# EAGLE design Output (EAGLE 7.2.0)
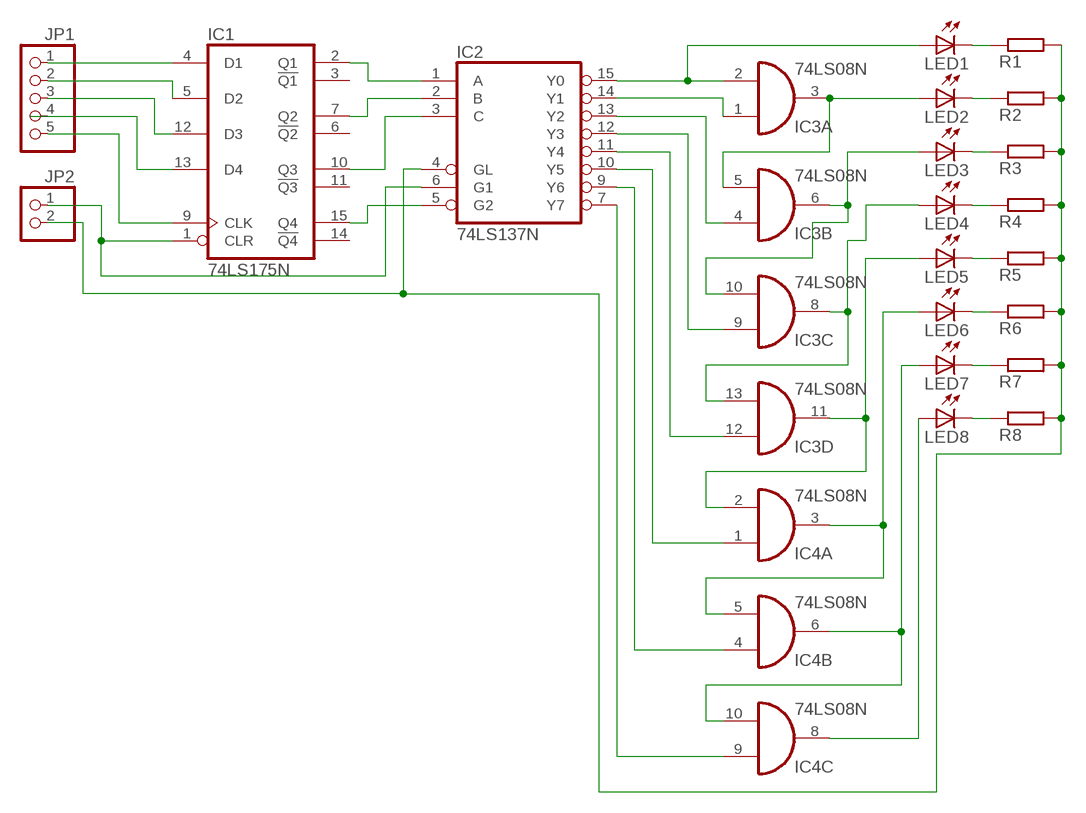
[diagram p0: schematic, sheet 1]

## Parts
IC1  74LS175N  [DIL16]
IC2  74LS137N  [DIL16]
IC3  74LS08N  [DIL14]
IC4  74LS08N  [DIL14]
JP1  PINHD-1X5  [1X05]
JP2  PINHD-1X2  [1X02]
LED1  LED5MM  [LED5MM]
LED2  LED5MM  [LED5MM]
LED3  LED5MM  [LED5MM]
LED4  LED5MM  [LED5MM]
LED5  LED5MM  [LED5MM]
LED6  LED5MM  [LED5MM]
LED7  LED5MM  [LED5MM]
LED8  LED5MM  [LED5MM]
R1  R-EU_0207/10  [0207/10]
R2  R-EU_0207/10  [0207/10]
R3  R-EU_0207/10  [0207/10]
R4  R-EU_0207/10  [0207/10]
R5  R-EU_0207/10  [0207/10]
R6  R-EU_0207/10  [0207/10]
R7  R-EU_0207/10  [0207/10]
R8  R-EU_0207/10  [0207/10]

## Nets
N$1: IC1.4(D1) JP1.1
N$2: IC1.5(D2) JP1.2
N$3: IC1.12(D3) JP1.3
N$4: IC1.13(D4)
N$5: IC1.9(CLK) JP1.5
N$6: IC1.1(CLR) IC2.6(G1) JP2.1
N$7: IC1.2(Q1) IC2.1(A)
N$8: IC1.7(Q2) IC2.2(B)
N$9: IC1.10(Q3) IC2.3(C)
N$10: IC1.15(Q4) IC2.5(G2)
N$11: IC2.4(GL) JP2.2 R1.2 R2.2 R3.2 R4.2 R5.2 R6.2 R7.2 R8.2
N$12: LED4.K(C) R4.1
N$13: LED1.K(C) R1.1
N$14: LED2.K(C) R2.1
N$15: LED3.K(C) R3.1
N$16: LED5.K(C) R5.1
N$17: LED6.K(C) R6.1
N$18: LED7.K(C) R7.1
N$19: LED8.K(C) R8.1
N$21: IC2.15(Y0) IC3.2(A:I1) LED1.A
N$22: IC2.14(Y1) IC3.1(A:I0)
N$23: IC3.3(A:O) IC3.5(B:I1) LED2.A
N$24: IC2.13(Y2) IC3.4(B:I0)
N$25: IC3.6(B:O) IC3.10(C:I1) LED3.A
N$26: IC3.8(C:O) IC3.13(D:I1) LED4.A
N$27: IC3.11(D:O) IC4.2(A:I1) LED5.A
N$28: IC4.3(A:O) IC4.5(B:I1) LED6.A
N$29: IC4.6(B:O) IC4.10(C:I1) LED7.A
N$30: IC4.8(C:O) LED8.A
N$31: IC2.12(Y3) IC3.9(C:I0)
N$32: IC2.11(Y4) IC3.12(D:I0)
N$33: IC2.10(Y5) IC4.1(A:I0)
N$34: IC2.9(Y6) IC4.4(B:I0)
N$35: IC2.7(Y7) IC4.9(C:I0)
Unconnected: IC1.3(!Q1) IC1.6(!Q2) IC1.11(!Q3) IC1.14(!Q4) IC4.11(D:O) IC4.12(D:I0) IC4.13(D:I1) JP1.4

## Power pins joined to a net without a drawn wire
GND: IC1.8(GND) IC2.8(GND) IC3.7(P:GND) IC4.7(P:GND)
VCC: IC1.16(VCC) IC2.16(VCC) IC3.14(P:VCC) IC4.14(P:VCC)

## Library data of the parts
IC1 = 74xx-eu:74*175: Qadruple D type FLIP FLOP, clear
IC2 = 74xx-eu:74*137: 3-line to 8-line DECODER/DEMULTIPLEXER, address LATCH
IC3 IC4 = 74xx-eu:74*08: Quad 2-input AND gate
JP1 = pinhead:PINHD-1X5: PIN HEADER
JP2 = pinhead:PINHD-1X2: PIN HEADER
LED1-LED8 = led:LED: LED OSRAM: - CHIPLED LG R971, LG N971, LY N971, LG Q971, LY Q971, LO R971, LY R971 LH N974, LH R974 LS Q976, LO Q976, LY Q976 LO Q996 - Hyper CHIPLED LW Q18S LB Q993, LB Q99A, LB R99A - SideLED LS A670, LO A670, LY A670, LG A670, LP A670 LB A673, LV A673, LT A673, LW A673 LH A674 LY A675 LS A676, LA A676, LO A676, LY A676, LW A676 LS A679, LY A679, LG A679 - Hyper Micro SIDELED® LS Y876, LA Y876, LO Y876, LY Y876 LT Y87S - SmartLED LW L88C, LW L88S LB L89C, LB L89S, LG L890 LS L89K, LO L89K, LY L89K LS L896, LA L896, LO L896, LY L896 - TOPLED LS T670, LO T670, LY T670, LG T670, LP T670 LSG T670, LSP T670, LSY T670, LOP T670, LYG T670 LG T671, LOG T671, LSG T671 LB T673, LV T673, LT T673, LW T673 LH T674 LS T676, LA T676, LO T676, LY T676, LB T676, LH T676, LSB T676, LW T676 LB T67C, LV T67C, LT T67C, LS T67K, LO T67K, LY T67K, LW E67C LS E67B, LA E67B, LO E67B, LY E67B, LB E67C, LV E67C, LT E67C LW T67C LS T679, LY T679, LG T679 LS T770, LO T770, LY T770, LG T770, LP T770 LB T773, LV T773, LT T773, LW T773 LH T774 LS E675, LA E675, LY E675, LS T675 LS T776, LA T776, LO T776, LY T776, LB T776 LHGB T686 LT T68C, LB T68C - Hyper Mini TOPLED® LB M676 - Mini TOPLED Santana® LG M470 LS M47K, LO M47K, LY M47K Source: http://www.osram.convergy.de LUXEON: - LUMILED® LXK2-PW12-R00, LXK2-PW12-S00, LXK2-PW14-U00, LXK2-PW14-V00 LXK2-PM12-R00, LXK2-PM12-S00, LXK2-PM14-U00 LXK2-PE12-Q00, LXK2-PE12-R00, LXK2-PE12-S00, LXK2-PE14-T00, LXK2-PE14-U00 LXK2-PB12-K00, LXK2-PB12-L00, LXK2-PB12-M00, LXK2-PB14-N00, LXK2-PB14-P00, LXK2-PB14-Q00 LXK2-PR12-L00, LXK2-PR12-M00, LXK2-PR14-Q00, LXK2-PR14-R00 LXK2-PD12-Q00, LXK2-PD12-R00, LXK2-PD12-S00 LXK2-PH12-R00, LXK2-PH12-S00 LXK2-PL12-P00, LXK2-PL12-Q00, LXK2-PL12-R00 Source: www.luxeon.com KINGBRIGHT: KA-3528ASYC Source: www.kingbright.com
R1-R8 = rcl:R-EU_: RESISTOR, European symbol

## Board
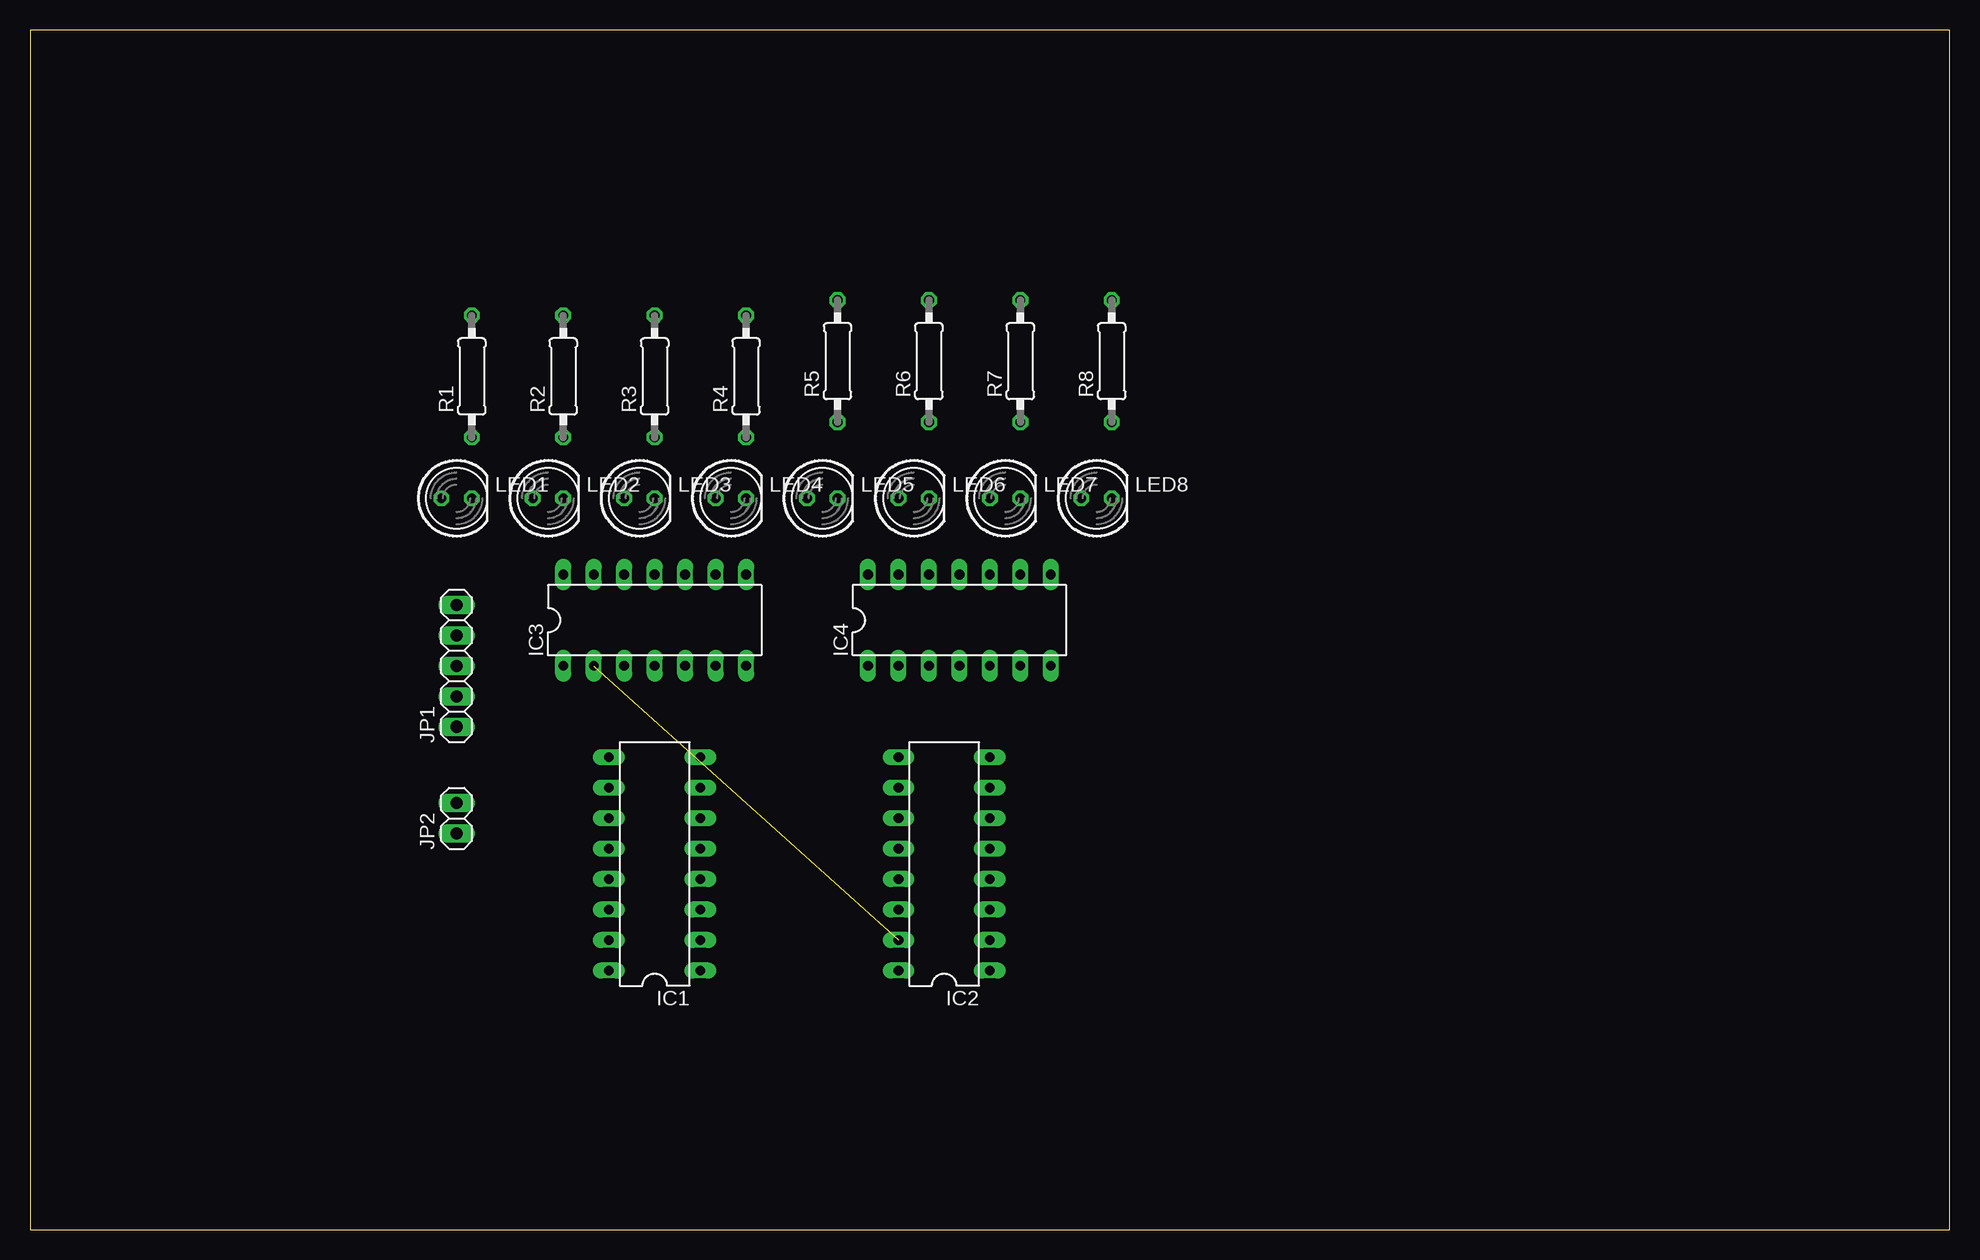
[diagram p1: board, top side]
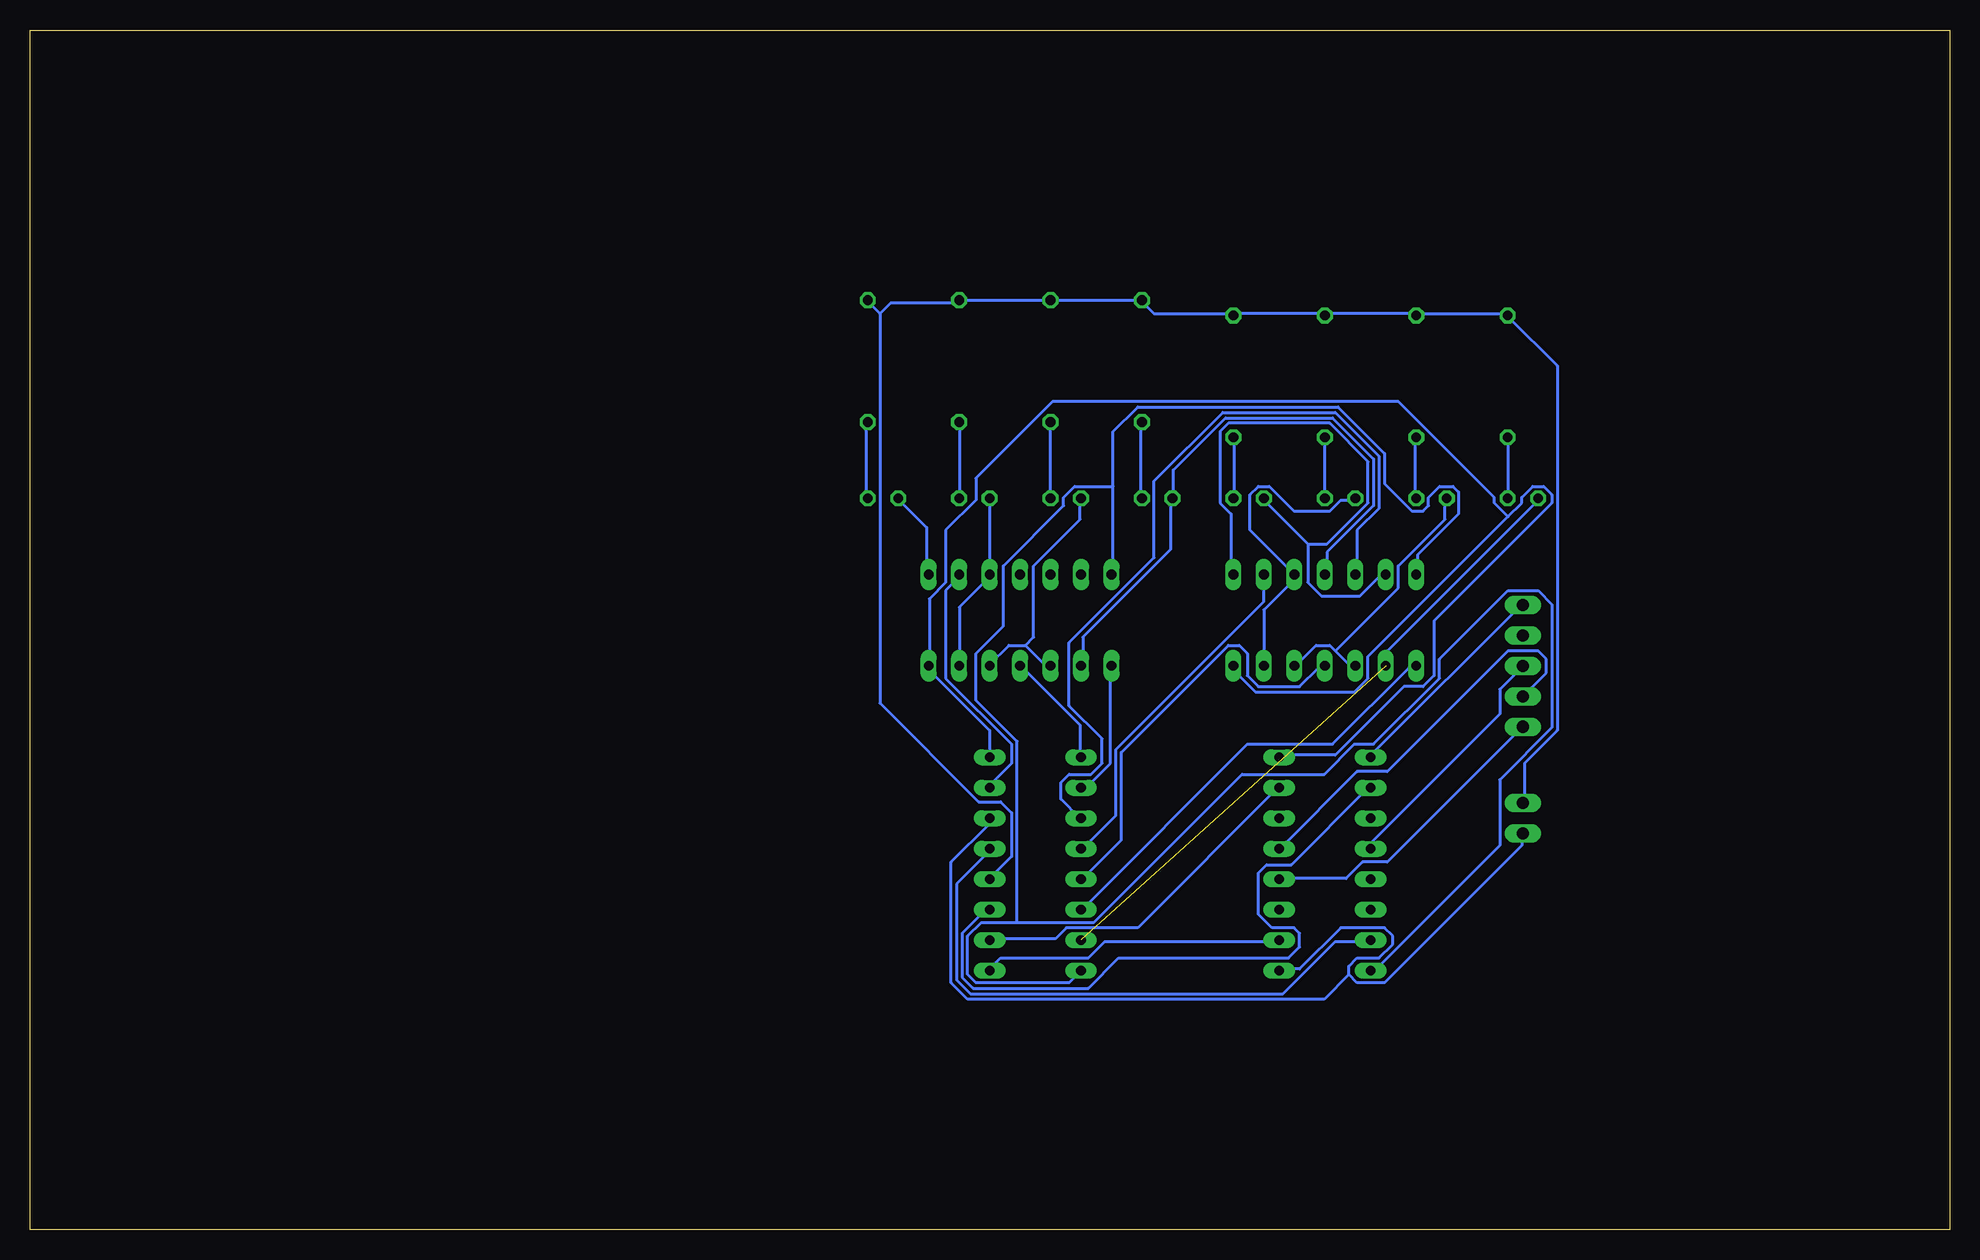
[diagram p2: board, bottom side, seen from below]

Size 160 x 100 mm. Coordinates in mm from the lower left corner, seen from the top.
Outline: 0,0 160,0 160,100 0,100 0,0
Copper layers (1*16): Top 0.035mm / dielectric 1.5mm / Bottom 0.035mm
Design rules "default": minimum track width 10mil, minimum drill 24mil, track to track 8mil, track to pad 8mil, pad to pad 8mil, via to via 8mil, smd to smd 8mil, copper to edge 40mil, drill to drill 8mil, minimum pad ring 10mil, minimum via ring 8mil, stop-mask expansion 4mil, vias tented up to drill 0mil, thermal gap 10mil

### Footprints (pad centres in the part's own frame; a part is rotated, then mirrored left to right if it is on the bottom)
DIL16 = drill 0.813 long: 1 -8.89,-3.81; 2 -6.35,-3.81; 3 -3.81,-3.81; 4 -1.27,-3.81; 5 1.27,-3.81; 6 3.81,-3.81; 7 6.35,-3.81; 8 8.89,-3.81; 9 8.89,3.81; 10 6.35,3.81; 11 3.81,3.81; 12 1.27,3.81; 13 -1.27,3.81; 14 -3.81,3.81; 15 -6.35,3.81; 16 -8.89,3.81
DIL14 = drill 0.813 long: 1 -7.62,-3.81; 2 -5.08,-3.81; 3 -2.54,-3.81; 4 0,-3.81; 5 2.54,-3.81; 6 5.08,-3.81; 7 7.62,-3.81; 8 7.62,3.81; 9 5.08,3.81; 10 2.54,3.81; 11 0,3.81; 12 -2.54,3.81; 13 -5.08,3.81; 14 -7.62,3.81
1X05 = drill 1.016 long: 1 -5.08,0; 2 -2.54,0; 3 0,0; 4 2.54,0; 5 5.08,0
1X02 = drill 1.016 long: 1 -1.27,0; 2 1.27,0
LED5MM = drill 0.813 octagon: A -1.27,0; K 1.27,0
0207/10 = drill 0.813 octagon: 1 -5.08,0; 2 5.08,0

### Placement (x,y rotation side)
IC1  52.07,30.48 90 top
IC2  76.2,30.48 90 top
IC3  52.07,50.8 0 top
IC4  77.47,50.8 0 top
JP1  35.56,46.99 90 top
JP2  35.56,34.29 90 top
LED1  35.56,60.96 0 top
LED2  43.18,60.96 0 top
LED3  50.8,60.96 0 top
LED4  58.42,60.96 0 top
LED5  66.04,60.96 0 top
LED6  73.66,60.96 0 top
LED7  81.28,60.96 0 top
LED8  88.9,60.96 0 top
R1  36.83,71.12 90 top
R2  44.45,71.12 90 top
R3  52.07,71.12 90 top
R4  59.69,71.12 90 top
R5  67.31,72.39 90 top
R6  74.93,72.39 90 top
R7  82.55,72.39 90 top
R8  90.17,72.39 90 top

### Tracks (layer width: path | path; a pad name or v marks a point on that pad's centre or on a via)
GND
  Bottom 0.254: IC2.8 80.01,41.6 85.27,46.86 IC4.7 85.04,47.09 85.04,52.58 83.67,53.95 83.67,58.29 81.15,60.81 81.15,62.64 74.75,69.04 45.95,69.04 37.95,61.04 37.95,60.58 36.8,59.44 | 36.8,59.44 48.46,47.78 48.46,45.95 49.61,44.81 57.84,44.81 59.89,46.86 IC3.7 | 36.8,59.44 35.66,60.58 35.66,61.04 34.75,61.95 33.83,61.95 33.15,61.27 33.15,60.58 42.98,50.75 42.98,46.18 43.89,45.26 45.49,45.26 51.21,39.55 55.78,39.55 IC1.8
N$1
  Bottom 0.254: IC1.4 55.78,29.26 50.29,29.26 48.92,30.63 46.86,30.63 35.66,41.83 JP1.1
N$2
  Bottom 0.254: JP1.2 33.6,46.41 33.6,47.55 34.29,48.23 36.8,48.23 46.86,38.18 49.38,38.18 55.78,31.77 IC1.5
N$3
  Bottom 0.254: IC1.12 48.23,31.77 48.23,32.23 37.49,42.98 37.49,45.03 35.66,46.86 JP1.3
N$5
  Bottom 0.254: IC1.9 48.23,39.55 35.66,52.12 JP1.5
N$6
  Bottom 0.254: 50.06,21.26 50.06,21.95 49.38,22.63 47.55,22.63 46.41,23.77 46.41,24.46 47.09,25.15 50.75,25.15 54.18,21.72 55.78,21.72 IC1.1 | 50.06,21.26 49.38,20.57 47.09,20.57 35.66,32 35.66,32.92 JP2.1 | IC2.6 80.01,33.83 83.21,30.63 83.21,20.57 81.84,19.2 52.12,19.2 50.06,21.26
N$7
  Bottom 0.254: IC1.2 56.01,24 70.41,24 71.78,22.63 79.1,22.63 80.01,21.72 IC2.1
N$8
  Bottom 0.254: IC2.2 80.01,24.23 74.52,24.23 73.61,25.15 67.67,25.15 56.01,36.8 IC1.7
N$9
  Bottom 0.254: IC1.10 48.46,36.8 54.86,30.4 56.92,30.4 57.61,29.72 57.61,26.29 56.46,25.15 54.63,25.15 54.18,24.69 54.18,23.55 55.09,22.63 69.27,22.63 71.78,20.12 81.38,20.12 82.3,21.03 82.3,24.69 80.47,26.52 80.01,26.52 IC2.3
N$10
  Bottom 0.254: IC1.15 48.46,24 51.21,24 55.55,19.66 81.61,19.66 82.75,20.8 82.75,28.8 80.01,31.55 IC2.5
N$11
  Bottom 0.254: JP2.2 35.43,35.66 35.43,38.86 32.69,41.6 32.69,72.01 36.8,76.12 R1.2 37.03,76.35 44.35,76.35 R2.2 44.58,76.35 51.89,76.35 R3.2 52.12,76.35 59.66,76.35 R4.2 59.89,76.35 66.29,76.35 67.21,77.27 R5.2 67.44,77.5 74.75,77.5 R6.2 74.98,77.5 82.53,77.5 R7.2 82.75,77.27 88.24,77.27 89.15,76.35 | 89.15,76.35 89.15,43.89 80.92,35.66 79.1,35.66 78.18,34.75 78.18,31.09 80.01,29.26 IC2.4 | 89.15,76.35 90.07,77.27 R8.2
N$12
  Bottom 0.254: LED4.K 59.66,61.04 59.66,65.84 R4.1
N$13
  Bottom 0.254: LED1.K 36.8,61.04 36.8,65.84 R1.1
N$14
  Bottom 0.254: LED2.K 44.58,61.04 44.58,65.84 R2.1
N$15
  Bottom 0.254: LED3.K 52.12,61.04 52.12,65.84 R3.1
N$16
  Bottom 0.254: LED5.K 67.44,61.04 67.44,67.21 R5.1
N$17
  Bottom 0.254: LED6.K 74.98,61.04 74.98,67.21 R6.1
N$18
  Bottom 0.254: LED7.K 82.53,61.04 82.53,67.21 R7.1
N$19
  Bottom 0.254: LED8.K 90.3,61.04 90.3,67.21 R8.1
N$21  (1 unrouted)
  Bottom 0.254: IC3.2 46.86,47.09 46.86,48.23 34.29,60.81 LED1.A
N$22
  Bottom 0.254: IC3.1 44.58,46.86 45.03,46.86 51.44,40.46 58.52,40.46 72.24,26.75 IC2.14
N$23
  Bottom 0.254: 51.21,48.23 51.66,48.69 52.81,48.69 54.41,47.09 IC3.5 | 51.21,48.23 50.06,47.09 49.61,47.09 IC3.3 | 51.21,48.23 45.95,53.49 45.95,55.32 42.06,59.21 42.06,60.81 LED2.A
N$24
  Bottom 0.254: IC3.4 52.12,46.86 52.58,46.86 54.18,45.26 57.61,45.26 58.52,46.18 58.52,48.01 59.21,48.69 60.12,48.69 69.04,39.78 69.04,32.46 72.24,29.26 IC2.13
N$25
  Bottom 0.254: IC3.6 57.15,51.66 54.41,54.41 IC3.10 58.29,58.29 58.29,61.27 57.61,61.95 56.69,61.95 54.63,59.89 51.66,59.89 50.75,60.81 49.61,60.81 LED3.A
N$26
  Bottom 0.254: 53.49,57.15 53.49,53.95 52.35,52.81 49.15,52.81 47.55,54.41 47.09,54.41 IC3.13 | 53.49,57.15 57.15,60.81 LED4.A | 53.49,57.15 51.89,57.15 48.46,60.58 48.46,64.01 51.66,67.21 60.12,67.21 60.81,66.52 60.81,60.58 59.89,59.66 59.89,54.63 IC3.8
N$27
  Bottom 0.254: IC4.2 72.24,47.09 72.24,49.38 64.92,56.69 64.92,60.81 LED5.A 64.69,61.04 64.69,63.32 60.35,67.67 51.44,67.67 48.01,64.24 48.01,60.35 51.89,56.46 51.89,54.63 IC3.11
N$28
  Bottom 0.254: 77.04,48.69 75.44,47.09 74.98,47.09 IC4.3 | 77.04,48.69 78.41,48.69 80.01,47.09 IC4.5 | 77.04,48.69 76.35,49.38 76.35,55.32 72.47,59.21 72.47,60.81 LED6.A
N$29
  Bottom 0.254: LED7.A IC4.10 80.01,54.41 82.53,51.89 82.53,47.09 IC4.6
N$30
  Bottom 0.254: IC4.8 85.27,54.63 85.27,58.52 87.55,60.81 LED8.A
N$31
  Bottom 0.254: IC3.9 57.15,52.35 69.49,40.01 69.49,34.52 72.24,31.77 IC2.12
N$32
  Bottom 0.254: IC3.12 49.38,54.63 49.38,58.29 47.55,60.12 47.55,64.47 51.21,68.12 60.58,68.12 66.29,62.41 66.29,56.01 73.38,48.92 73.38,43.66 70.64,40.92 70.64,38.86 71.55,37.95 73.38,37.95 74.07,37.26 74.07,35.89 72.47,34.29 IC2.11
N$33
  Bottom 0.254: IC4.1 69.95,46.86 69.95,38.86 71.78,37.03 72.24,37.03 IC2.10
N$34
  Bottom 0.254: IC2.9 72.47,39.55 72.47,42.06 77.27,46.86 IC4.4
N$35
  Bottom 0.254: IC2.7 80.01,37.03 78.18,38.86 78.18,40.46 83.67,45.95 83.67,53.26 82.53,54.41 IC4.9
VCC
  Bottom 0.254: 69.72,61.95 69.72,54.63 IC4.14 | 69.72,61.95 69.72,66.52 67.67,68.58 50.98,68.58 47.09,64.69 47.09,62.18 44.81,59.89 43.89,59.89 43.43,60.35 43.43,61.04 42.52,61.95 41.38,61.95 40.92,61.49 40.92,59.66 44.35,56.24 44.35,54.63 IC3.14 | 77.72,25.6 80.7,25.6 81.84,24.46 81.84,21.26 81.15,20.57 73.38,20.57 72.47,21.49 IC2.16 | 77.72,25.6 71.32,25.6 58.98,37.95 52.12,37.95 49.61,40.46 48.01,40.46 42.52,45.95 42.52,47.55 36.8,53.26 34.29,53.26 33.15,52.12 33.15,41.83 37.49,37.49 37.49,32 47.78,21.72 48.23,21.72 IC1.16 | 69.72,61.95 72.92,61.95 73.84,61.04 73.84,60.35 78.87,55.32 78.87,50.29 81.15,48.01 81.15,44.12 77.72,40.69 77.72,25.6